# EAGLE design main (EAGLE 9.6.2)
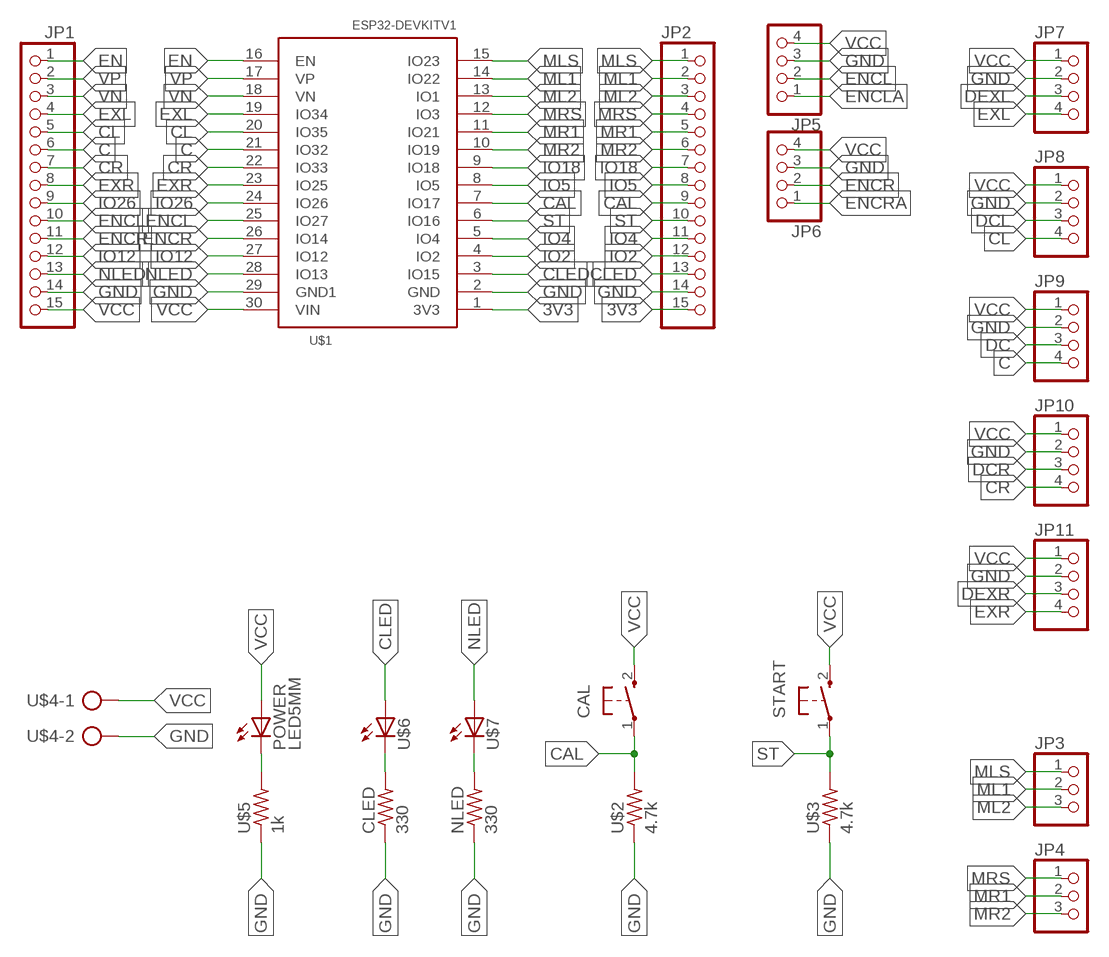
[diagram p0: schematic, sheet 1]

## Parts
CAL  PUSH_BUTTON  [B3F-10XX]
CLED  330  RES-7  [0204/7]
JP1  PINHD-1X15  [1X15]
JP2  PINHD-1X15  [1X15]
JP3  PINHD-1X3  [1X03]
JP4  PINHD-1X3  [1X03]
JP5  PINHD-1X4  [1X04]
JP6  PINHD-1X4  [1X04]
JP7  PINHD-1X4  [1X04]
JP8  PINHD-1X4  [1X04]
JP9  PINHD-1X4  [1X04]
JP10  PINHD-1X4  [1X04]
JP11  PINHD-1X4  [1X04]
NLED  330  RES-7  [0204/7]
POWER  LED5MM  [LED5MM]
START  PUSH_BUTTON  [B3F-10XX]
U$1  ESP32DEVKITV1  [ESP32-DEVKITV1]
U$2  4.7k  RES-7  [0204/7]
U$3  4.7k  RES-7  [0204/7]
U$4  CON_PTR_2(V_2)  [AK300/2]
U$5  1k  RES-7  [0204/7]
U$6  LED5MM  [LED5MM]
U$7  LED5MM  [LED5MM]

## Nets
3V3: JP2.15 U$1.1(3V3)
C: JP1.6 JP9.4 U$1.21(IO32)
CAL: CAL.1(P) JP2.9 U$1.7(IO17) U$2.2
CL: JP1.5 JP8.4 U$1.20(IO35)
CLED: JP2.13 U$1.3(IO15) U$6.A
CR: JP1.7 JP10.4 U$1.22(IO33)
DC: JP9.3
DCL: JP8.3
DCR: JP10.3
DEXL: JP7.3
DEXR: JP11.3
EN: JP1.1 U$1.16(EN)
ENCL: JP1.10 JP5.2 U$1.25(IO27)
ENCLA: JP5.1
ENCR: JP1.11 JP6.2 U$1.26(IO14)
ENCRA: JP6.1
EXL: JP1.4 JP7.4 U$1.19(IO34)
EXR: JP1.8 JP11.4 U$1.23(IO25)
GND: CLED.1 JP1.14 JP2.14 JP5.3 JP6.3 JP7.2 JP8.2 JP9.2 JP10.2 JP11.2 NLED.1 U$1.2(GND) U$1.29(GND1) U$2.1 U$3.1 U$4.2 U$5.1
IO2: JP2.12 U$1.4(IO2)
IO4: JP2.11 U$1.5(IO4)
IO5: JP2.8 U$1.8(IO5)
IO12: JP1.12 U$1.27(IO12)
IO18: JP2.7 U$1.9(IO18)
IO26: JP1.9 U$1.24(IO26)
ML1: JP2.2 JP3.2 U$1.14(IO22)
ML2: JP2.3 JP3.3 U$1.13(IO1)
MLS: JP2.1 JP3.1 U$1.15(IO23)
MR1: JP2.5 JP4.2 U$1.11(IO21)
MR2: JP2.6 JP4.3 U$1.10(IO19)
MRS: JP2.4 JP4.1 U$1.12(IO3)
N$2: POWER.K(C) U$5.2
N$4: CLED.2 U$6.K(C)
N$5: NLED.2 U$7.K(C)
NLED: JP1.13 U$1.28(IO13) U$7.A
ST: JP2.10 START.1(P) U$1.6(IO16) U$3.2
VCC: CAL.2(S) JP1.15 JP5.4 JP6.4 JP7.1 JP8.1 JP9.1 JP10.1 JP11.1 POWER.A START.2(S) U$1.30(VIN) U$4.1
VN: JP1.3 U$1.18(VN)
VP: JP1.2 U$1.17(VP)

## Library data of the parts
CAL START = MIA_LIBRARY-2-2-2:PUSH_BUTTON: OMRON SWITCH
CLED NLED U$2 U$3 U$5 = MIA_LIBRARY-2-2-2:RES-7
JP1 JP2 = MIA_LIBRARY-2-2-2:PINHD-1X15: PIN HEADER
JP3 JP4 = MIA_LIBRARY-2-2-2:PINHD-1X3: PIN HEADER
JP5-JP11 = MIA_LIBRARY-2-2-2:PINHD-1X4: PIN HEADER
POWER U$6 U$7 = MIA_LIBRARY-2-2-2:LED5MM
U$1 = MIA_LIBRARY-2-2-2:ESP32DEVKITV1
U$4 = MIA_LIBRARY-2-2-2:CON_PTR_2(V_2)

## Board
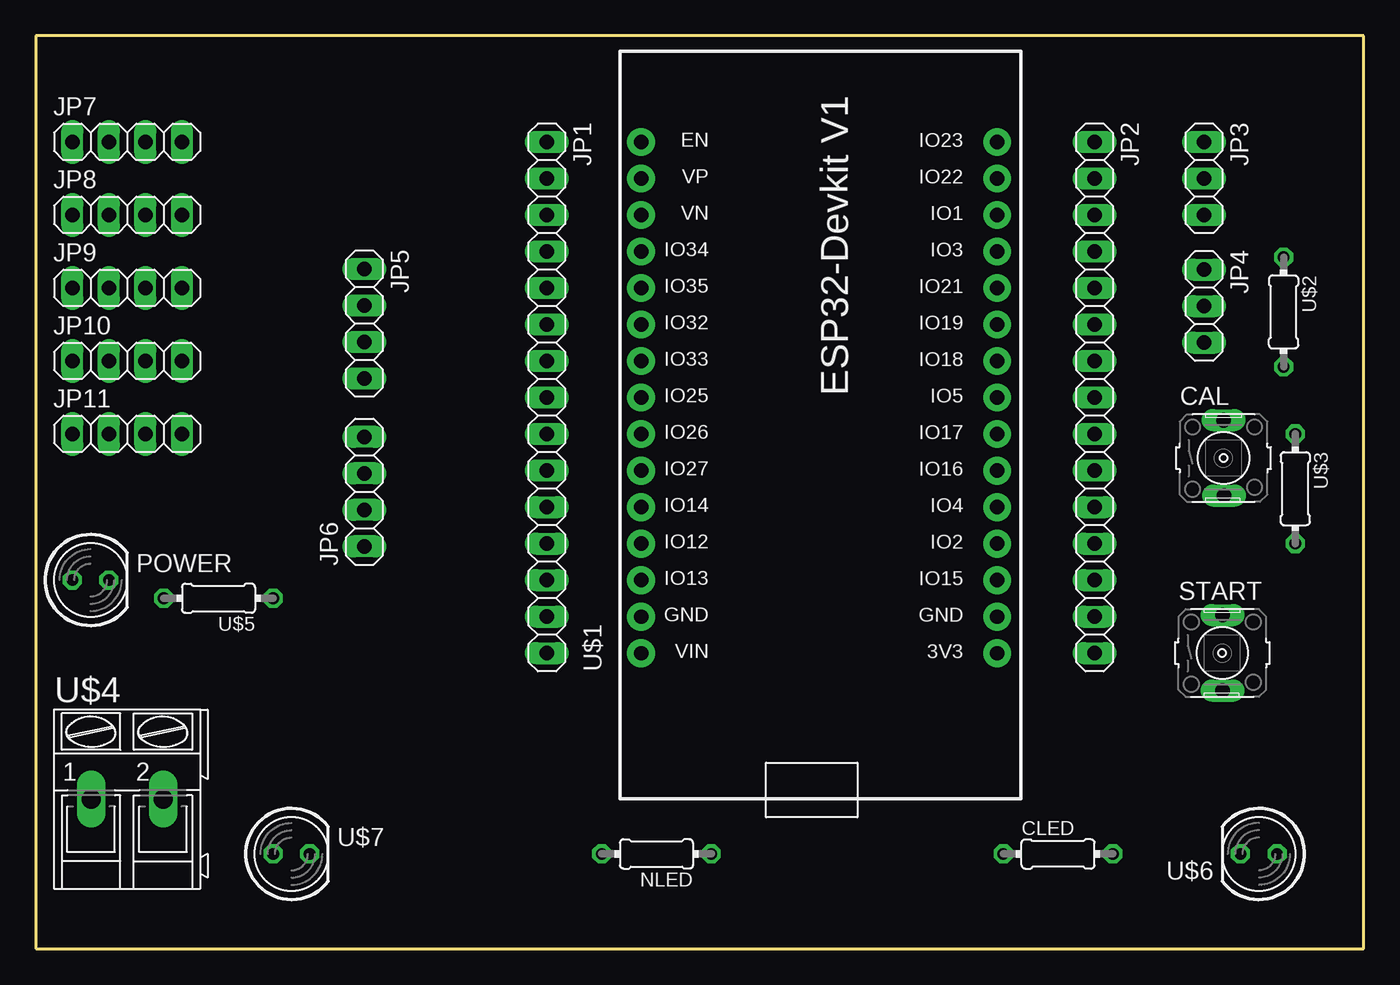
[diagram p1: board, top side]
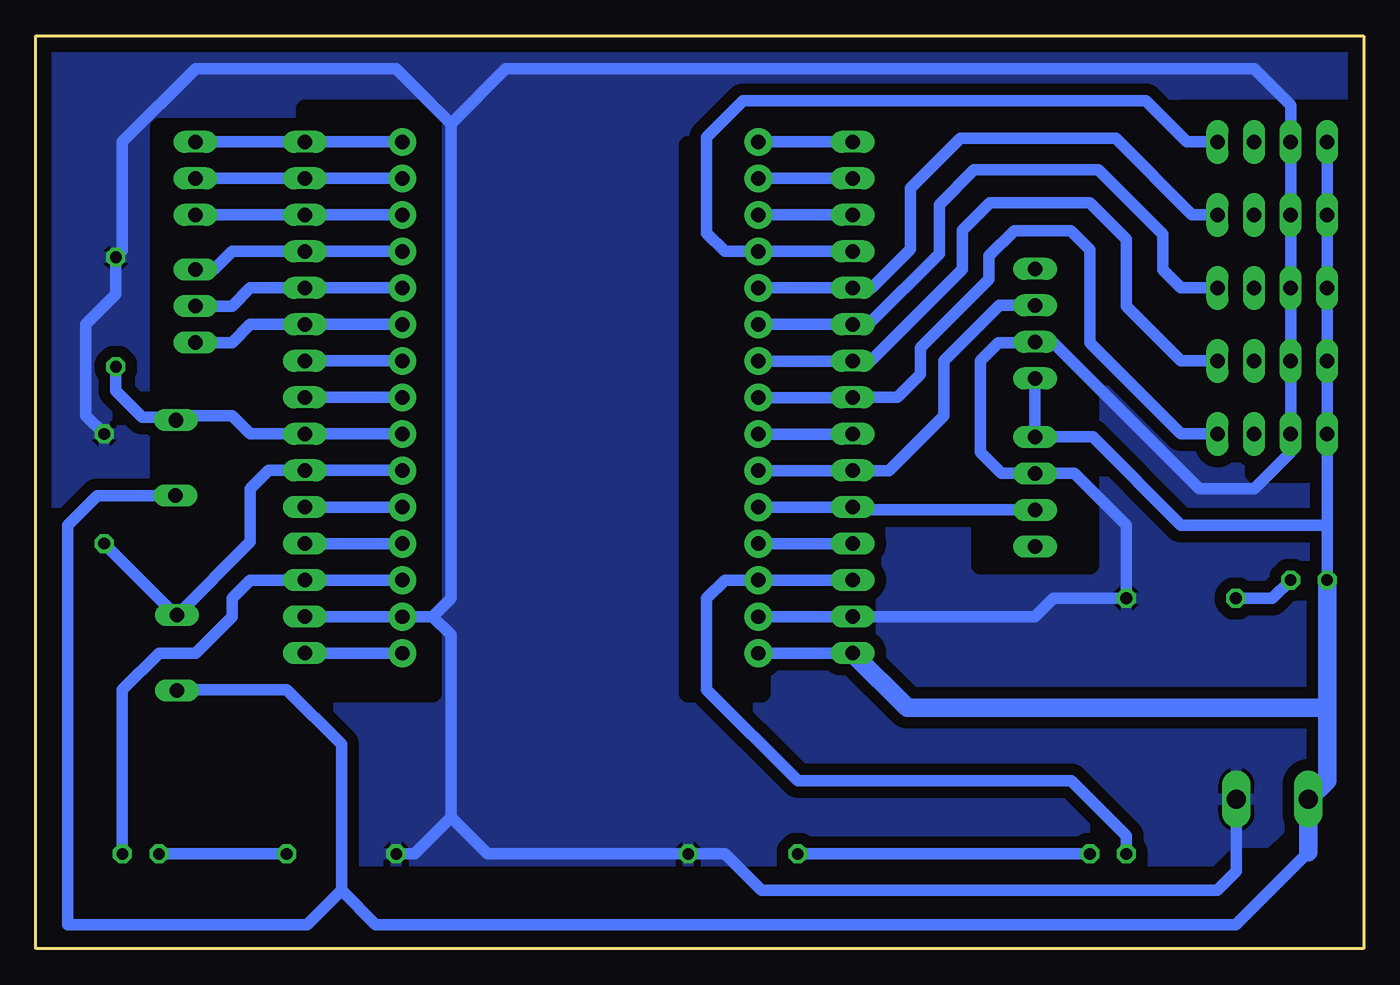
[diagram p2: board, bottom side, seen from below]

Size 92.38 x 63.49 mm. Coordinates in mm from the lower left corner, seen from the top.
Outline: 0,0 92.38,0 92.38,63.49 0,63.49 0,0
Copper layers (1*16): Top 0.035mm / dielectric 1.5mm / Bottom 0.035mm
Design rules "default *": minimum track width 6mil, minimum drill 0.35mm, track to track 0.8mm, track to pad 0.8mm, pad to pad 6mil, via to via 6mil, smd to smd 6mil, copper to edge 40mil, drill to drill 6mil, minimum pad ring 10mil, minimum via ring 8mil, stop-mask expansion 4mil, vias tented up to drill 0mil, thermal gap 10mil

### Footprints (pad centres in the part's own frame; a part is rotated, then mirrored left to right if it is on the bottom)
B3F-10XX = drill 1.016 long: 1 0.013,2.636; 2 0.029,-2.605
0204/7 = drill 0.813 octagon: 1 -3.81,0; 2 3.81,0
1X15 = drill 1.016 long: 1 -17.78,0; 2 -15.24,0; 3 -12.7,0; 4 -10.16,0; 5 -7.62,0; 6 -5.08,0; 7 -2.54,0; 8 0,0; 9 2.54,0; 10 5.08,0; 11 7.62,0; 12 10.16,0; 13 12.7,0; 14 15.24,0; 15 17.78,0
1X03 = drill 1.016 long: 1 -2.54,0; 2 0,0; 3 2.54,0
1X04 = drill 1.016 long: 1 -3.81,0; 2 -1.27,0; 3 1.27,0; 4 3.81,0
LED5MM = drill 0.813 octagon: A -1.27,0; K 1.27,0
ESP32-DEVKITV1 = drill 1 pad 1.93: 1 -22.87,-13.54; 2 -20.33,-13.54; 3 -17.79,-13.54; 4 -15.25,-13.54; 5 -12.71,-13.54; 6 -10.17,-13.54; 7 -7.63,-13.54; 8 -5.09,-13.54; 9 -2.55,-13.54; 10 -0.01,-13.54; 11 2.53,-13.54; 12 5.07,-13.54; 13 7.61,-13.54; 14 10.15,-13.54; 15 12.69,-13.54; 16 12.69,11.23; 17 10.15,11.23; 18 7.61,11.23; 19 5.07,11.23; 20 2.53,11.23; 21 -0.01,11.23; 22 -2.55,11.23; 23 -5.09,11.23; 24 -7.63,11.23; 25 -10.17,11.23; 26 -12.71,11.23; 27 -15.25,11.23; 28 -17.79,11.23; 29 -20.33,11.23; 30 -22.87,11.23
AK300/2 = drill 1.321 long: 1 -2.515,0; 2 2.489,0

### Placement (x,y rotation side)
CAL  82.63,34.13 0 top
CLED  71.12,6.59 0 top
JP1  35.56,38.34 270 top
JP2  73.66,38.34 270 top
JP3  81.28,53.58 270 top
JP4  81.28,44.69 270 top
JP5  22.86,43.48 270 top
JP6  22.86,31.79 90 top
JP7  6.35,56.12 0 top
JP8  6.35,51.04 0 top
JP9  6.35,45.96 0 top
JP10  6.35,40.88 0 top
JP11  6.35,35.8 0 top
NLED  43.18,6.59 180 top
POWER  3.81,25.64 0 top
START  82.55,20.56 0 top
U$1  53.34,43.42 90 top
U$2  86.81,44.29 270 top
U$3  87.63,31.99 270 top
U$4  6.35,10.4 0 top
U$5  12.7,24.37 180 top
U$6  85.09,6.59 180 top
U$7  17.78,6.59 0 top

### Tracks (layer width: path | path; a pad name or v marks a point on that pad's centre or on a via)
3V3
  Bottom 0.813: JP2.15 66.89,20.56 U$1.1
C
  Bottom 0.813: JP9.4 12.7,45.96 13.97,47.23 13.97,49.7 18.44,54.17 27.11,54.17 29.53,51.75 29.53,48.33 34.44,43.42 JP1.6 42.1,43.42 U$1.21
CAL
  Bottom 0.813: U$1.7 66.89,35.8 JP2.9 77.47,35.8 78.74,37.07 82.33,37.07 82.44,36.97 | 82.44,36.97 CAL.1 | U$2.2 86.81,38.8 84.98,36.97 82.44,36.97
CL
  Bottom 0.813: JP8.4 11.94,51.04 17.25,56.36 28.07,56.36 31.53,52.9 31.53,48.65 34.21,45.96 JP1.5 42.1,45.96 U$1.20
CLED
  Bottom 0.813: U$1.3 66.89,25.64 JP2.13 77.47,25.64 78.74,24.37 78.74,23.1 81.28,20.56 83.82,20.56 86.36,18.02 U$6.A
CR
  Bottom 0.813: JP10.4 12.7,40.88 16.51,44.69 16.51,49.35 19.05,51.89 26.01,51.89 27.91,49.99 27.91,47.26 34.29,40.88 JP1.7 U$1.22
EN
  Bottom 0.813: JP1.1 42.1,56.12 U$1.16
ENCL
  Bottom 0.813: JP5.2 25.34,44.75 29.21,40.88 29.21,37.07 33.03,33.25 JP1.10 | U$1.25 JP1.10 | JP1.10
ENCR
  Bottom 0.813: JP1.11 | JP6.2 35.36,30.52 JP1.11 | U$1.26 JP1.11
EXL
  Bottom 0.813: JP7.4 12.28,56.12 15.14,58.99 43.18,58.99 45.72,56.45 45.72,49.77 44.45,48.5 42.12,48.5 U$1.19 42.1,48.5 JP1.4
EXR
  Bottom 0.813: JP11.4 12.7,35.8 19.05,42.15 19.05,48.62 20.38,49.95 24.31,49.95 26.07,48.2 26.07,46.57 30.83,41.81 30.83,39.96 32.44,38.34 JP1.8 U$1.23
GND
  Bottom 0.813: U$4.2 8.84,5.38 10.16,4.05 41.91,4.05 44.45,6.59 NLED.1 60.96,6.59 63.5,9.13 | U$1.29 42.1,23.1 JP1.14 22.86,23.1 21.59,24.37 U$5.1 16.51,29.45 20.12,33.06 JP6.3 25.2,33.06 26.67,34.53 26.67,40.88 25.4,42.15 22.92,42.15 JP5.3 22.8,42.15 21.59,42.15 11.43,31.99 7.62,31.99 5.08,34.53 JP11.2 JP10.2 JP9.2 JP8.2 JP7.2 5.08,58.66 7.62,61.2 59.69,61.2 63.5,57.39 | U$1.2 66.89,23.1 | 66.89,23.1 JP2.14 | U$3.1 88.9,37.07 88.9,43.42 86.81,45.51 U$2.1 86.36,48.55 86.36,56.12 81.28,61.2 67.31,61.2 63.5,57.39 | 63.5,57.39 63.5,24.37 64.77,23.1 | 64.77,23.1 66.89,23.1 | 64.77,23.1 63.5,21.83 63.5,9.13 | CLED.1 66.04,6.59 63.5,9.13
  pour Bottom: -1.27,-1.27 -1.27,64.77 95.25,64.77 95.25,-1.27
  cutout Bottom: 67.31,20.56 67.31,25.64 73.66,25.64 73.66,20.56
  cutout Bottom: 41.91,20.56 41.91,25.64 35.56,25.64 35.56,20.56
  cutout Bottom: 2.54,33.02 7.62,33.02 7.62,57.15 2.54,57.15
  cutout Bottom: 19.05,49.53 19.05,26.67 26.67,26.67 26.67,49.53
  cutout Bottom: 73.66,16.51 73.66,25.4 80.01,25.4 80.01,16.51
  cutout Bottom: 74.93,57.15 74.93,17.78 83.82,17.78 83.82,57.15
  cutout Bottom: 1.27,58.42 12.7,58.42 12.7,54.61 1.27,54.61
  cutout Bottom: 41.91,55.88 41.91,17.78 46.99,17.78 46.99,55.88
  cutout Bottom: 64.77,17.78 64.77,58.42 73.66,58.42 73.66,17.78
  cutout Bottom: 5.08,7.62 5.08,6.35 8.89,2.54 68.58,2.54 71.12,5.08 10.16,5.08 8.89,6.35 6.35,6.35
IO2
  Bottom 0.813: JP2.12 66.89,28.18 U$1.4
IO4
  Bottom 0.813: JP2.11 66.89,30.72 U$1.5
IO5
  Bottom 0.813: JP2.8 66.89,38.34 U$1.8
IO12
  Bottom 0.813: JP1.12 42.1,28.18 U$1.27
IO18
  Bottom 0.813: JP2.7 66.89,40.88 U$1.9
IO26
  Bottom 0.813: U$1.24 JP1.9
ML1
  Bottom 0.813: U$1.14 66.89,53.58 JP2.2 JP3.2
ML2
  Bottom 0.813: U$1.13 66.89,51.04 JP2.3 JP3.3
MLS
  Bottom 0.813: U$1.15 66.89,56.12 JP2.1 JP3.1
MR1
  Bottom 0.813: U$1.11 66.89,45.96 JP2.5 77.47,45.96 78.74,44.69 JP4.2
MR2
  Bottom 0.813: U$1.10 66.89,43.42 JP2.6 77.47,43.42 78.74,42.15 JP4.3
MRS
  Bottom 0.813: U$1.12 66.89,48.5 JP2.4 78.74,48.5 80.01,47.23 JP4.1
N$2
  Bottom 0.813: U$5.2 6.35,24.37 POWER.K
N$4
  Bottom 0.813: CLED.2 U$6.K
N$5
  Bottom 0.813: U$7.K NLED.2
NLED
  Bottom 0.813: U$7.A 16.51,7.86 20.32,11.67 39.37,11.67 45.72,18.02 45.72,24.37 44.45,25.64 42.12,25.64 U$1.28 JP1.13
ST
  Bottom 0.813: U$1.6 66.89,33.26 JP2.10 76.2,33.26 77.47,31.99 77.47,28.29 START.1 82.65,23.2 U$3.2
VCC
  Bottom 0.813: 3.83,6.72 8.89,1.67 68.73,1.67 71.12,4.05 | 2.54,29.45 JP11.1 JP10.1 JP9.1 JP8.1 JP7.1 | 2.54,29.45 POWER.A | JP5.4 JP6.4 18.85,35.6 12.7,29.45 2.54,29.45 | U$1.30 42.1,20.56 JP1.15 | CAL.2 88.1,31.52 90.17,29.45 90.17,1.67 73.51,1.67 71.12,4.05 | START.2 82.51,18.02 74.93,18.02 71.12,14.21 71.12,4.05
  Bottom 1.27: 3.83,6.72 U$4.1 2.54,11.7 2.54,16.75 | POWER.A 2.54,16.75 | 2.54,16.75 31.75,16.75 JP1.15
VN
  Bottom 0.813: JP1.3 42.1,51.04 U$1.18
VP
  Bottom 0.813: JP1.2 42.1,53.58 U$1.17